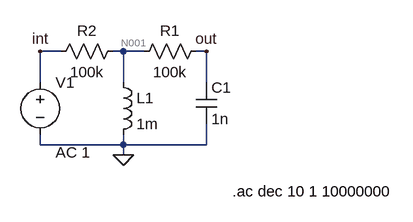
[diagram p0: schematic Draft1.asc]
Draft1.asc, the LTspice schematic file:
Version 4
SHEET 1 880 680
WIRE -80 80 -112 80
WIRE 16 80 0 80
WIRE 48 80 16 80
WIRE 144 80 128 80
WIRE -112 128 -112 80
WIRE 16 128 16 80
WIRE 144 128 144 80
WIRE -112 224 -112 208
WIRE 16 224 16 208
WIRE 16 224 -112 224
WIRE 144 224 144 192
WIRE 144 224 16 224
WIRE 16 240 16 224
FLAG 16 240 0
FLAG 144 80 out
FLAG -112 80 int
SYMBOL cap 128 128 R0
SYMATTR InstName C1
SYMATTR Value 1n
SYMBOL res 144 64 R90
WINDOW 0 0 56 VBottom 2
WINDOW 3 32 56 VTop 2
SYMATTR InstName R1
SYMATTR Value 100k
SYMBOL res 16 64 R90
WINDOW 0 0 56 VBottom 2
WINDOW 3 32 56 VTop 2
SYMATTR InstName R2
SYMATTR Value 100k
SYMBOL ind 0 112 R0
SYMATTR InstName L1
SYMATTR Value 1m
SYMBOL voltage -112 112 R0
WINDOW 123 24 124 Left 2
WINDOW 39 0 0 Left 0
SYMATTR Value2 AC 1
SYMATTR InstName V1
SYMATTR Value ""
TEXT 184 296 Left 2 !.ac dec 10 1 10000000

The netlist it stands for:
* Draft1.asc
C1 out 0 1n
R1 out N001 100k
R2 N001 int 100k
L1 N001 0 1m
V1 int 0 AC 1
.ac dec 10 1 10000000
.backanno
.end

* Results of the author's LTspice run, read from the files saved beside the schematic
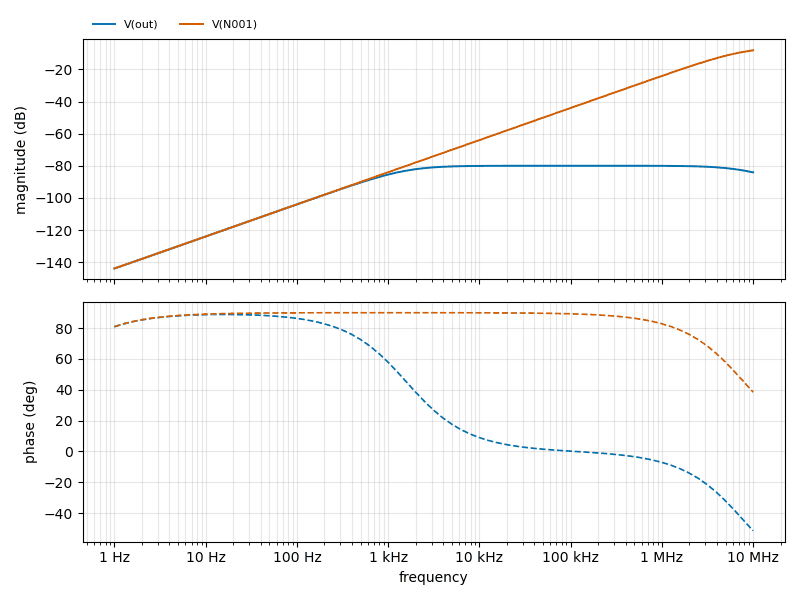
[diagram p1: AC Analysis of Draft1.asc, plotted from the saved traces]
* AC Analysis, 1 run:
*   V(out): -143.93 dB at 1 Hz, -84.11 dB at 10 MHz, peak -80.00 dB at 125.9 kHz, 3 dB below the peak at 1.592 kHz and 7.958 MHz
*   V(N001): -143.93 dB at 1 Hz, -8.15 dB at 10 MHz, peak -8.15 dB at 10 MHz, 3 dB below the peak at 5.302 MHz